# Altium schematic sheet MIPI_MUX.SchDoc: MIPI MUX
size A3; Author: Silvio Navaretti; CompanyName: ARDUINO; DrawnBy: Silvio Navaretti; Engineer: Silvio Navaretti; Organization: ARDUINO; SheetNumber: 42; SheetTotal: 51; RevAuthor: Silvio Navaretti
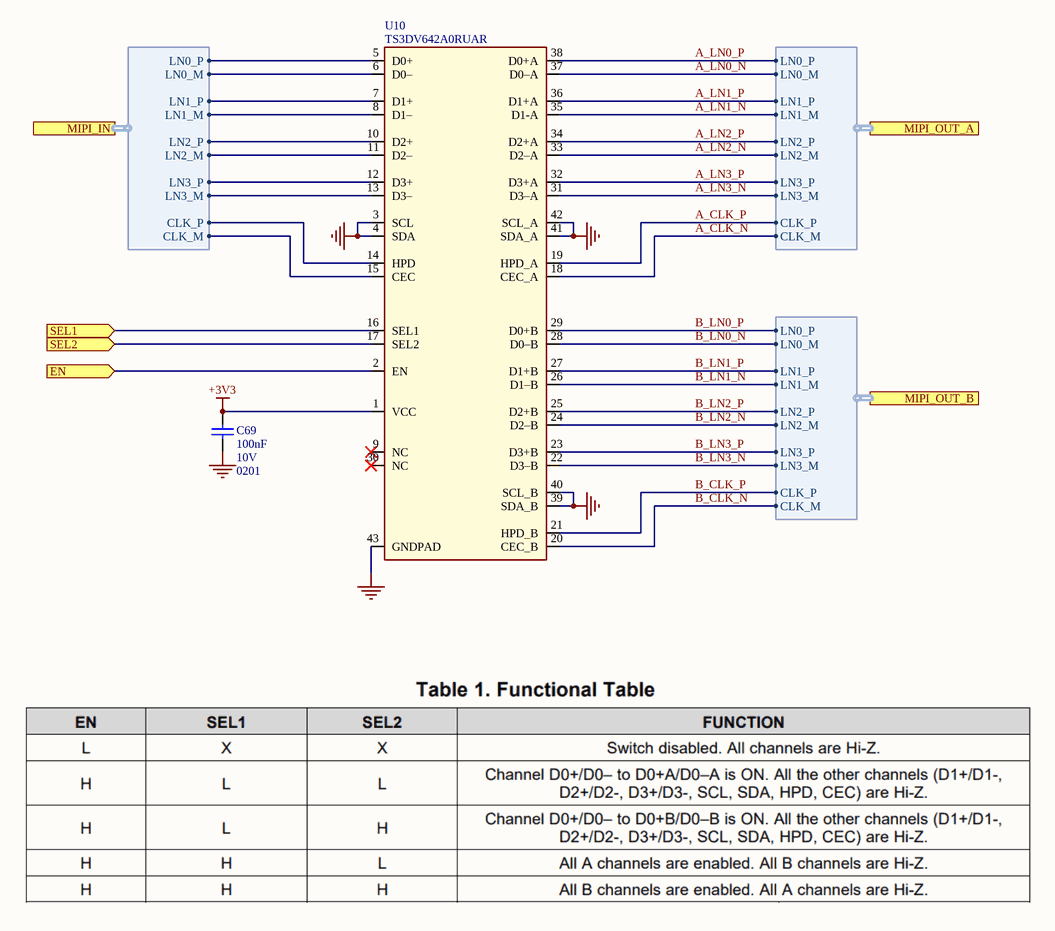
[diagram p0: MIPI_MUX.SchDoc]

## Parts
C69  value 100nF  Voltage: 10V  Case Code (Imperial): 0201  [CAP-0201]  (hidden comment: CL03A104KP3NNNC)
U10  TS3DV642A0RUAR  [TI RUA0042A WQFN 42 pin pitch 0.5mm 3.5x9mm]

## Ports
EN (in), MIPI_IN (harness MIPI_4LANES), MIPI_OUT_A (harness MIPI_4LANES), MIPI_OUT_B (harness MIPI_4LANES), SEL1 (in), SEL2 (in)

## Harnesses
MIPI_4LANES: LN3_M, LN2_M, LN2_P, LN0_M, LN0_P, CLK_M, CLK_P, LN1_M, LN1_P, LN3_P

## Nets
+3V3: C69.2 U10.1(VCC)
GND: C69.1 U10.3(SCL) U10.4(SDA) U10.39(SDA_B) U10.40(SCL_B) U10.41(SDA_A) U10.42(SCL_A) U10.43(GNDPAD)
A_CLK_N: U10.18(CEC_A) ; port MIPI_OUT_A.CLK_M
A_CLK_P: U10.19(HPD_A) ; port MIPI_OUT_A.CLK_P
A_LN0_N: U10.37(D0–A) ; port MIPI_OUT_A.LN0_M
A_LN0_P: U10.38(D0+A) ; port MIPI_OUT_A.LN0_P
A_LN1_N: U10.35(D1-A) ; port MIPI_OUT_A.LN1_M
A_LN1_P: U10.36(D1+A) ; port MIPI_OUT_A.LN1_P
A_LN2_N: U10.33(D2–A) ; port MIPI_OUT_A.LN2_M
A_LN2_P: U10.34(D2+A) ; port MIPI_OUT_A.LN2_P
A_LN3_N: U10.31(D3–A) ; port MIPI_OUT_A.LN3_M
A_LN3_P: U10.32(D3+A) ; port MIPI_OUT_A.LN3_P
B_CLK_N: U10.20(CEC_B) ; port MIPI_OUT_B.CLK_M
B_CLK_P: U10.21(HPD_B) ; port MIPI_OUT_B.CLK_P
B_LN0_N: U10.28(D0–B) ; port MIPI_OUT_B.LN0_M
B_LN0_P: U10.29(D0+B) ; port MIPI_OUT_B.LN0_P
B_LN1_N: U10.26(D1–B) ; port MIPI_OUT_B.LN1_M
B_LN1_P: U10.27(D1+B) ; port MIPI_OUT_B.LN1_P
B_LN2_N: U10.24(D2–B) ; port MIPI_OUT_B.LN2_M
B_LN2_P: U10.25(D2+B) ; port MIPI_OUT_B.LN2_P
B_LN3_N: U10.22(D3–B) ; port MIPI_OUT_B.LN3_M
B_LN3_P: U10.23(D3+B) ; port MIPI_OUT_B.LN3_P
EN: U10.2(EN) ; port EN
SEL1: U10.16(SEL1) ; port SEL1
SEL2: U10.17(SEL2) ; port SEL2
NetU10_5: U10.5(D0+) ; port MIPI_IN.LN0_P
NetU10_6: U10.6(D0–) ; port MIPI_IN.LN0_M
NetU10_7: U10.7(D1+) ; port MIPI_IN.LN1_P
NetU10_8: U10.8(D1–) ; port MIPI_IN.LN1_M
NetU10_10: U10.10(D2+) ; port MIPI_IN.LN2_P
NetU10_11: U10.11(D2–) ; port MIPI_IN.LN2_M
NetU10_12: U10.12(D3+) ; port MIPI_IN.LN3_P
NetU10_13: U10.13(D3–) ; port MIPI_IN.LN3_M
NetU10_14: U10.14(HPD) ; port MIPI_IN.CLK_P
NetU10_15: U10.15(CEC) ; port MIPI_IN.CLK_M

Not connected (* = marked no-connect by the designer): U10 9(NC)* 30(NC)*

## Notes on the sheet
- Title:
- ID:
- Date:
- Time:
- Version:
- Sheet
- of
- RevAuthor:
- Reference Designs ARE PROVIDED "AS IS" AND "WITH ALL FAULTS. Arduino SA DISCLAIMS ALL OTHER WARRANTIES, EXPRESS OR IMPLIED, REGARDING PRODUCTS, INCLUDING BUT NOT LIMITED TO, ANY IMPLIED WARRANTIES OF MERCHANTABILITY OR FITNESS FOR A PARTICULAR PURPOSE.
  Arduino SA may make changes to specifications and product descriptions at any time, without notice. The Customer must not rely on the absence or characteristics of any features or instructions marked "reserved" or "undefined".
  Arduino SA reserves these for future definition and shall have no responsibility whatsoever for conflicts or incompatibilities arising from future changes to them. The product information on the Web Site or Materials is subject to change without notice.
  Do not finalize a design with this info. ARDUINO and other Arduino brands and logos and Trademarks of Arduino SA. All Arduino SA Trademarks cannot be used without owner's formal permission.
- File:
- Author:

## Library data of the parts
C69 = C0113-A.6: CAP CHIP 0201 100nF 10% 10V X5R; Manufacturer: Samsung Electro-Mechanics; Code Arduino: C0113; Technology: Ceramic; Part Number: CL03A104KP3NNNC; Dielectric: X5R; Tolerance: 10%
U10 = U0522-A.2: IC MUX SWITCH 6GHz, 12 channel 2:1 bidirectional switch, port A 6.9GHz port B 7.5GHz, Vcc 2.6V to 4.5V, WQFN42 9x3.5mm; Manufacturer: Texas Instruments; Code Arduino: U0522; Part Number: TS3DV642A0RUAR